# Altium schematic sheet InputStage.SchDoc: Input Stage
size A3; Organization: BME AUT; Address1: Magyar tudósok krt. 2.; Address2: Q épület; Address3: Budapest; Address4: H-1117; DocumentNumber: 1; Revision: 1.0; SheetNumber: 1; SheetTotal: 2
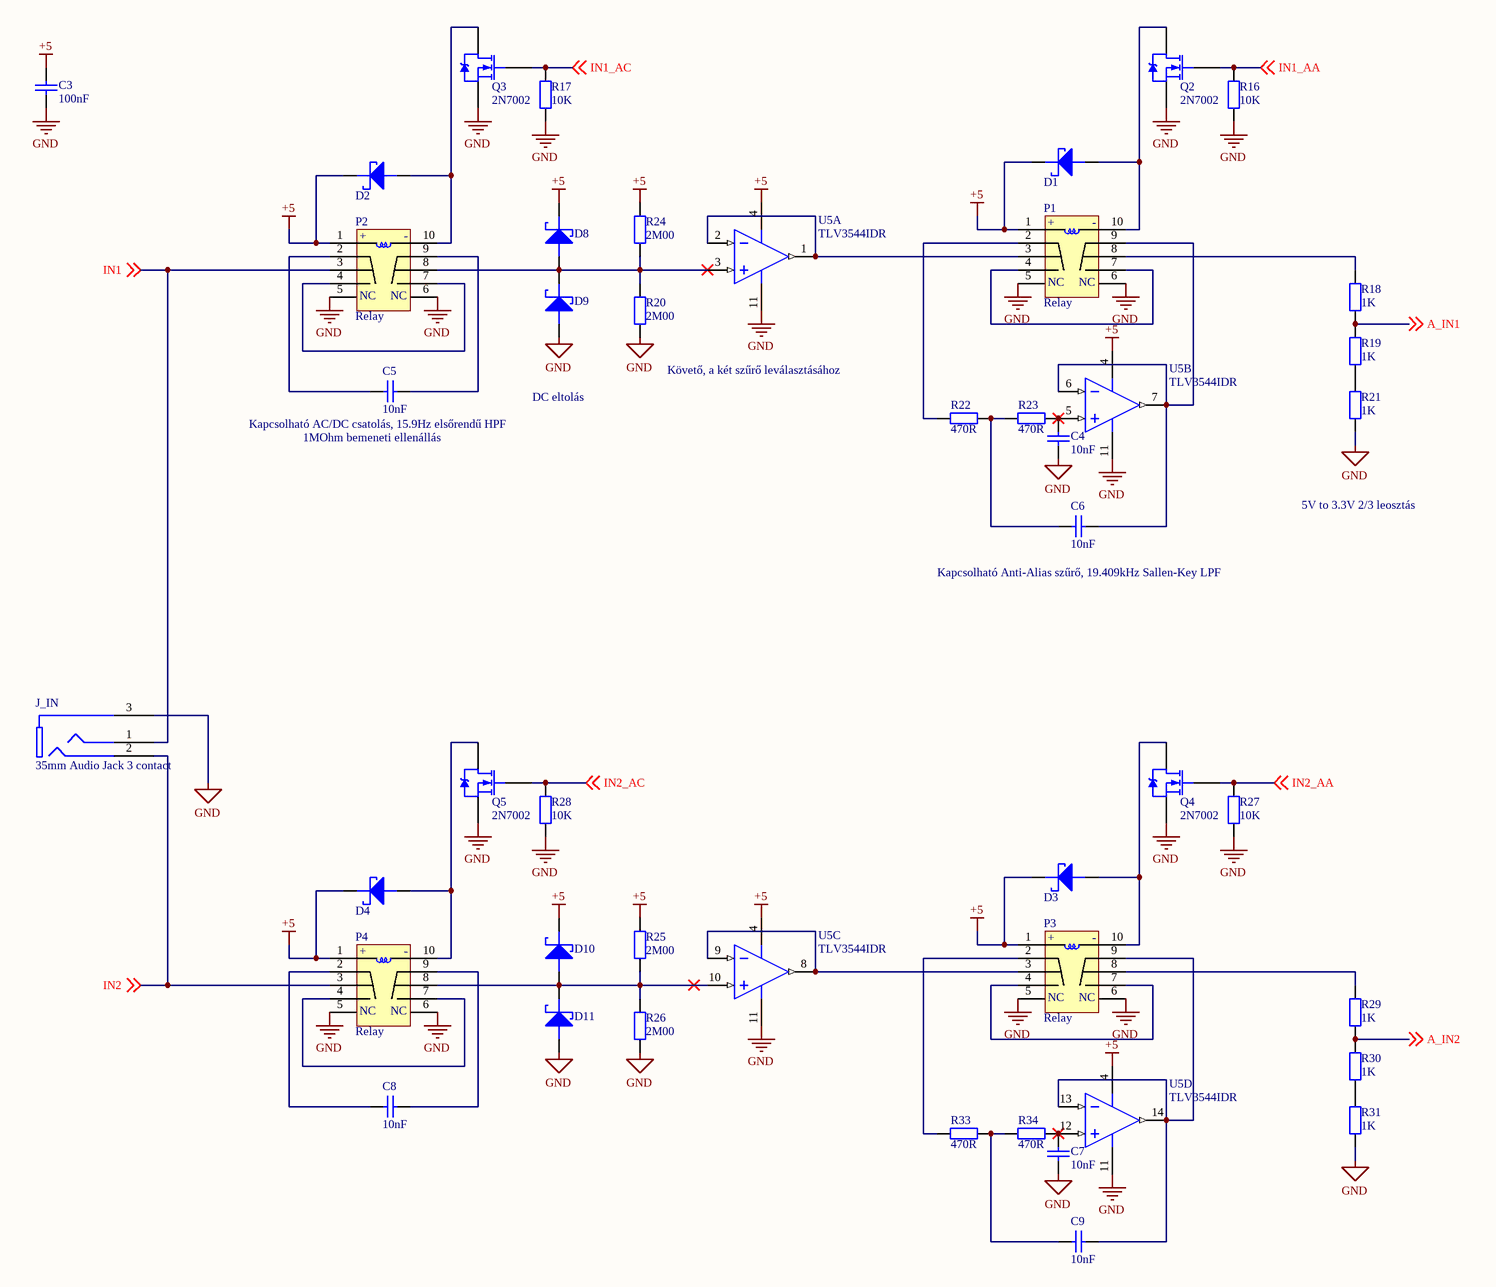
[diagram p0: InputStage.SchDoc]

## Parts
C3  100nF  [FP_0805_CAP_085]
C4  10nF  [FP_0805_CAP_085]
C5  10nF  [FP_0805_CAP_085]
C6  10nF  [FP_0805_CAP_085]
C7  10nF  [FP_0805_CAP_085]
C8  10nF  [FP_0805_CAP_085]
C9  10nF  [FP_0805_CAP_085]
D1  SCHOTTKY SMA  [FP_SMA]  (value not drawn)
D2  SCHOTTKY SMA  [FP_SMA]  (value not drawn)
D3  SCHOTTKY SMA  [FP_SMA]  (value not drawn)
D4  SCHOTTKY SMA  [FP_SMA]  (value not drawn)
D8  SCHOTTKY SMA  [FP_SMA]  (value not drawn)
D9  SCHOTTKY SMA  [FP_SMA]  (value not drawn)
D10  SCHOTTKY SMA  [FP_SMA]  (value not drawn)
D11  SCHOTTKY SMA  [FP_SMA]  (value not drawn)
J_IN  35mm Audio Jack 3 contact  [FP_35MM_JACK_SMALL_3PIN]
P1  Relay  [FP_RELAY]
P2  Relay  [FP_RELAY]
P3  Relay  [FP_RELAY]
P4  Relay  [FP_RELAY]
Q2  2N7002  [FP_SOT23-3]
Q3  2N7002  [FP_SOT23-3]
Q4  2N7002  [FP_SOT23-3]
Q5  2N7002  [FP_SOT23-3]
R16  10K  [FP_0805_RES]
R17  10K  [FP_0805_RES]
R18  1K  [FP_0805_RES]
R19  1K  [FP_0805_RES]
R20  2M00  [FP_0805_RES]
R21  1K  [FP_0805_RES]
R22  470R  [FP_0805_RES]
R23  470R  [FP_0805_RES]
R24  2M00  [FP_0805_RES]
R25  2M00  [FP_0805_RES]
R26  2M00  [FP_0805_RES]
R27  10K  [FP_0805_RES]
R28  10K  [FP_0805_RES]
R29  1K  [FP_0805_RES]
R30  1K  [FP_0805_RES]
R31  1K  [FP_0805_RES]
R33  470R  [FP_0805_RES]
R34  470R  [FP_0805_RES]
U5  TLV3544IDR  [FP_SOIC127P600X175-14M]  (parts A,B,C,D of 4)

## Nets
+5: C3.2 D1.1(CATHODE) D2.1(CATHODE) D3.1(CATHODE) D4.1(CATHODE) D8.1(CATHODE) D10.1(CATHODE) P1.1(+) P2.1(+) P3.1(+) P4.1(+) R24.2 R25.2 U5.4(V+)
GND: C3.1 C4.1 C7.1 D9.2(ANODE) D11.2(ANODE) J_IN.3(GND) P1.5 P1.6 P2.5 P2.6 P3.5 P3.6 P4.5 P4.6 Q2.3(S) Q3.3(S) Q4.3(S) Q5.3(S) R16.2 R17.1 R20.1 R21.1 R26.1 R27.2 R28.2 R31.1 U5.11(GND)
A_IN1: R18.1 R19.2 ; off-sheet A_IN1
A_IN2: R29.1 R30.2 ; off-sheet A_IN2
IN1: J_IN.1(SLEEVE1) P2.3 ; off-sheet IN1
IN1_AA: Q2.1(G) R16.1 ; off-sheet IN1_AA
IN1_AC: Q3.1(G) R17.2 ; off-sheet IN1_AC
IN2: J_IN.2(TIP) P4.3 ; off-sheet IN2
IN2_AA: Q4.1(G) R27.1 ; off-sheet IN2_AA
IN2_AC: Q5.1(G) R28.1 ; off-sheet IN2_AC
NetC4_2: C4.2 R23.2 U5.5(IN2+)
NetC5_1: C5.1 P2.2
NetC5_2: C5.2 P2.9
NetC6_1: C6.1 R22.2 R23.1
NetC6_2: C6.2 P1.9 U5.6(IN2-) U5.7(OUT2)
NetC7_2: C7.2 R34.2 U5.12(IN4+)
NetC8_1: C8.1 P4.2
NetC8_2: C8.2 P4.9
NetC9_1: C9.1 R33.2 R34.1
NetC9_2: C9.2 P3.9 U5.13(IN4-) U5.14(OUT4)
NetD1_2: D1.2(ANODE) P1.10(-) Q2.2(D)
NetD2_2: D2.2(ANODE) P2.10(-) Q3.2(D)
NetD3_2: D3.2(ANODE) P3.10(-) Q4.2(D)
NetD4_2: D4.2(ANODE) P4.10(-) Q5.2(D)
NetD8_2: D8.2(ANODE) D9.1(CATHODE) P2.8 R20.2 R24.1 U5.3(IN1+)
NetD10_2: D10.2(ANODE) D11.1(CATHODE) P4.8 R25.1 R26.2 U5.10(IN3+)
NetP1_2: P1.2 R22.1
NetP1_3: P1.3 U5.1(OUT1) U5.2(IN1-)
NetP1_4: P1.4 P1.7
NetP1_8: P1.8 R18.2
NetP2_4: P2.4 P2.7
NetP3_2: P3.2 R33.1
NetP3_3: P3.3 U5.8(OUT3) U5.9(IN3-)
NetP3_4: P3.4 P3.7
NetP3_8: P3.8 R29.2
NetP4_4: P4.4 P4.7
NetR19_1: R19.1 R21.2
NetR30_1: R30.1 R31.2

## Notes on the sheet
- DC eltolás
- (near R20) Követő, a két szűrő leválasztásához
- (near C5) Kapcsolható AC/DC csatolás, 15.9Hz elsőrendű HPF
- (near C5) 1MOhm bemeneti ellenállás
- 5V to 3.3V 2/3 leosztás
- (near C6) Kapcsolható Anti-Alias szűrő, 19.409kHz Sallen-Key LPF
- Title
- Size:
- Date:
- A3
- Number:
- Time:
- Revision:
- Sheet
- of
- File:
- (in symbol Relay Mini DPDT) NC

## Library data of the parts
C3 = CAP 100nF: Capacitor; Tolerance: 10%; Voltage: 50V; Name: 100nF 0805 10% 50V X7R 0805B104K500CT (WAL); Supplier: Lomex; Reference: 82-10-76; Value: 100nF
C4-C9 = CAP 10nF: Capacitor; Tolerance: 10%; Voltage: 100V; Name: 10nF 0805 10% 100V X7R 08051C103KAT2A (AVX); Supplier: Lomex; Reference: 82-11-02; Value: 10nF
D1-D4 D8-D11 = SCHOTTKY SMA: Schottky diode; pin to pad: 1>2 2>1; Name: 1A 40V DO-214AC SCH.RECT.LOW Vf SSL14 (TSC) SMA; Current: 1A; Voltage: 40V; Supplier: Lomex; Reference: 83-02-20
J_IN = 35mm Audio Jack 3 contact: 3.5mm Audio Jack MX-387GL; Name: MX-387GL -  Phone Audio Connector, 3 Contacts, Jack, 3.5 mm, PCB Mount, Metal Body; Reference: 1267376; Supplier: Farnell
P1-P4 = Relay Mini DPDT: Mini DPDT relay 14x9x5mm; Name: MECH 5V 2xMORSE 1A/30VDC 0.5A/12VAC A5W-K (TAK) 178R 14x9x5mm; Reference: 42-17-08; Supplier: Lomex
Q2-Q5 = 2N7002: N-channel MOSFET; pin to pad: 2>3 3>2; Name: MOSFET Transistor, N Channel, 300mA, 60V, 2.8 ohm, 10V, 2V; Voltage: 60V; Current: 300mA; Supplier: Lomex; Reference: 86-05-52
R16 R17 R27 R28 = RES 10K: Resistor; Tolerance: 5%; Power: 125mW; Name: 10K0 0805 5% CR-05JL7---10K 0.125W (VIK); Supplier: Lomex; Reference: 81-30-45; Value: 10K
R18 R19 R21 R29-R31 = RES 1K: Resistor; Tolerance: 5%; Power: 125mW; Name: 1K00 0805 5% WR08X102JTL 0.125W (WAL); Supplier: Lomex; Reference: 81-27-93; Value: 1K
R20 R24-R26 = RES 2M: Resistor; Tolerance: 1%; Power: 125mW; Name: 2M00 0805 1% CR-05FL7---2M0 0.125W (VIK); Supplier: Lomex; Reference: 80-17-98; Value: 2M00
R22 R23 R33 R34 = RES 470R: Resistor; Tolerance: 5%; Power: 125mW; Name: 470R 0805 5% CR-05JL7--470R 0.125W (VIK); Supplier: Lomex; Reference: 81-10-83; Value: 470R
U5 = TLV3544IDR: Operational Amplifier, RRIO, 4 Amplifier, 200 MHz, 150 V/µs, 2.5V to 5.5V, ± 1.25V to ± 2.75V, SOIC; Reference: 2851094; Name: TLV3544IDR . -  Operational Amplifier; Supplier: Farnell